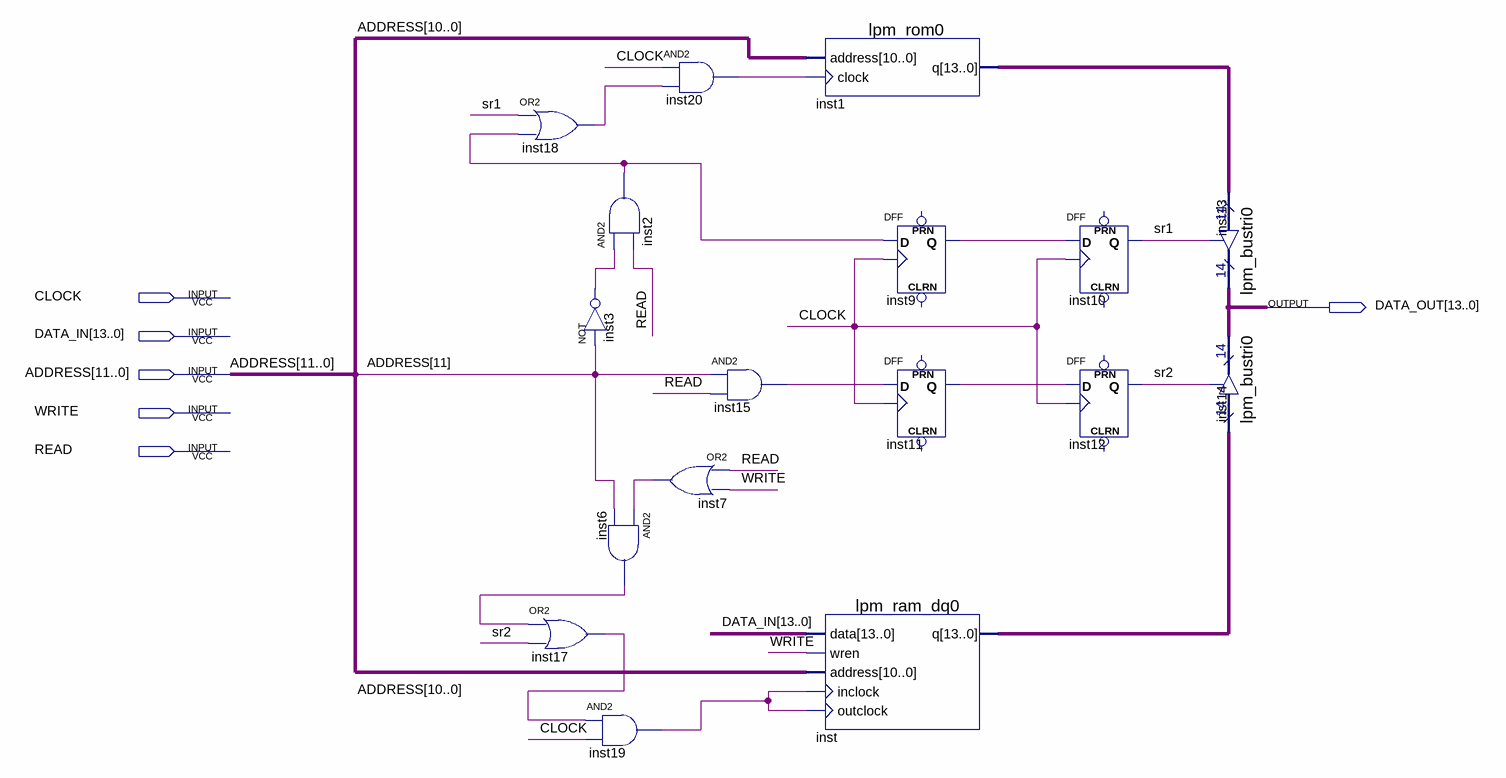
[diagram p0: schematic sheet]
// Quartus schematic MEMORY.bdf as structural Verilog: 17 symbols, 6 pins
module MEMORY (
  input  CLOCK,
  input  [13:0] DATA_IN,
  input  [11:0] ADDRESS,
  input  WRITE,
  input  READ,
  output [13:0] DATA_OUT
);

  wire inst2_out, inst3_out, inst6_out, inst7_out, inst9_q, inst11_q, inst15_out, inst17_out, inst18_out,
       inst19_out, inst20_out, sr1, sr2;
  wire [13:0] inst1_q, inst_q;

  or inst18 (inst18_out, sr1, inst2_out);
  or inst17 (inst17_out, inst6_out, sr2);
  and inst2 (inst2_out, inst3_out, READ);
  not inst3 (inst3_out, ADDRESS[11]);
  and inst6 (inst6_out, inst7_out, ADDRESS[11]);
  and inst19 (inst19_out, inst17_out, CLOCK);
  and inst20 (inst20_out, CLOCK, inst18_out);
  or inst7 (inst7_out, READ, WRITE);
  and inst15 (inst15_out, ADDRESS[11], READ);
  lpm_rom0 inst1 (.address(ADDRESS[10:0]), .clock(inst20_out), .q(inst1_q));
  lpm_ram_dq0 inst (
    .data(DATA_IN), .wren(WRITE), .address(ADDRESS[10:0]), .inclock(inst19_out), .outclock(inst19_out),
    .q(inst_q));
  DFF inst9 (.CLK(CLOCK), .D(inst2_out), .Q(inst9_q));  // open: CLRN, PRN
  DFF inst11 (.CLK(CLOCK), .D(inst15_out), .Q(inst11_q));  // open: CLRN, PRN
  DFF inst10 (.CLK(CLOCK), .D(inst9_q), .Q(sr1));  // open: CLRN, PRN
  DFF inst12 (.CLK(CLOCK), .D(inst11_q), .Q(sr2));  // open: CLRN, PRN
  lpm_bustri0 inst13 (.enabledt(sr1), .data(inst1_q), .tridata(DATA_OUT));
  lpm_bustri0 inst14 (.enabledt(sr2), .data(inst_q), .tridata(DATA_OUT));
endmodule
